# Altium schematic sheet adc.SchDoc
size A3
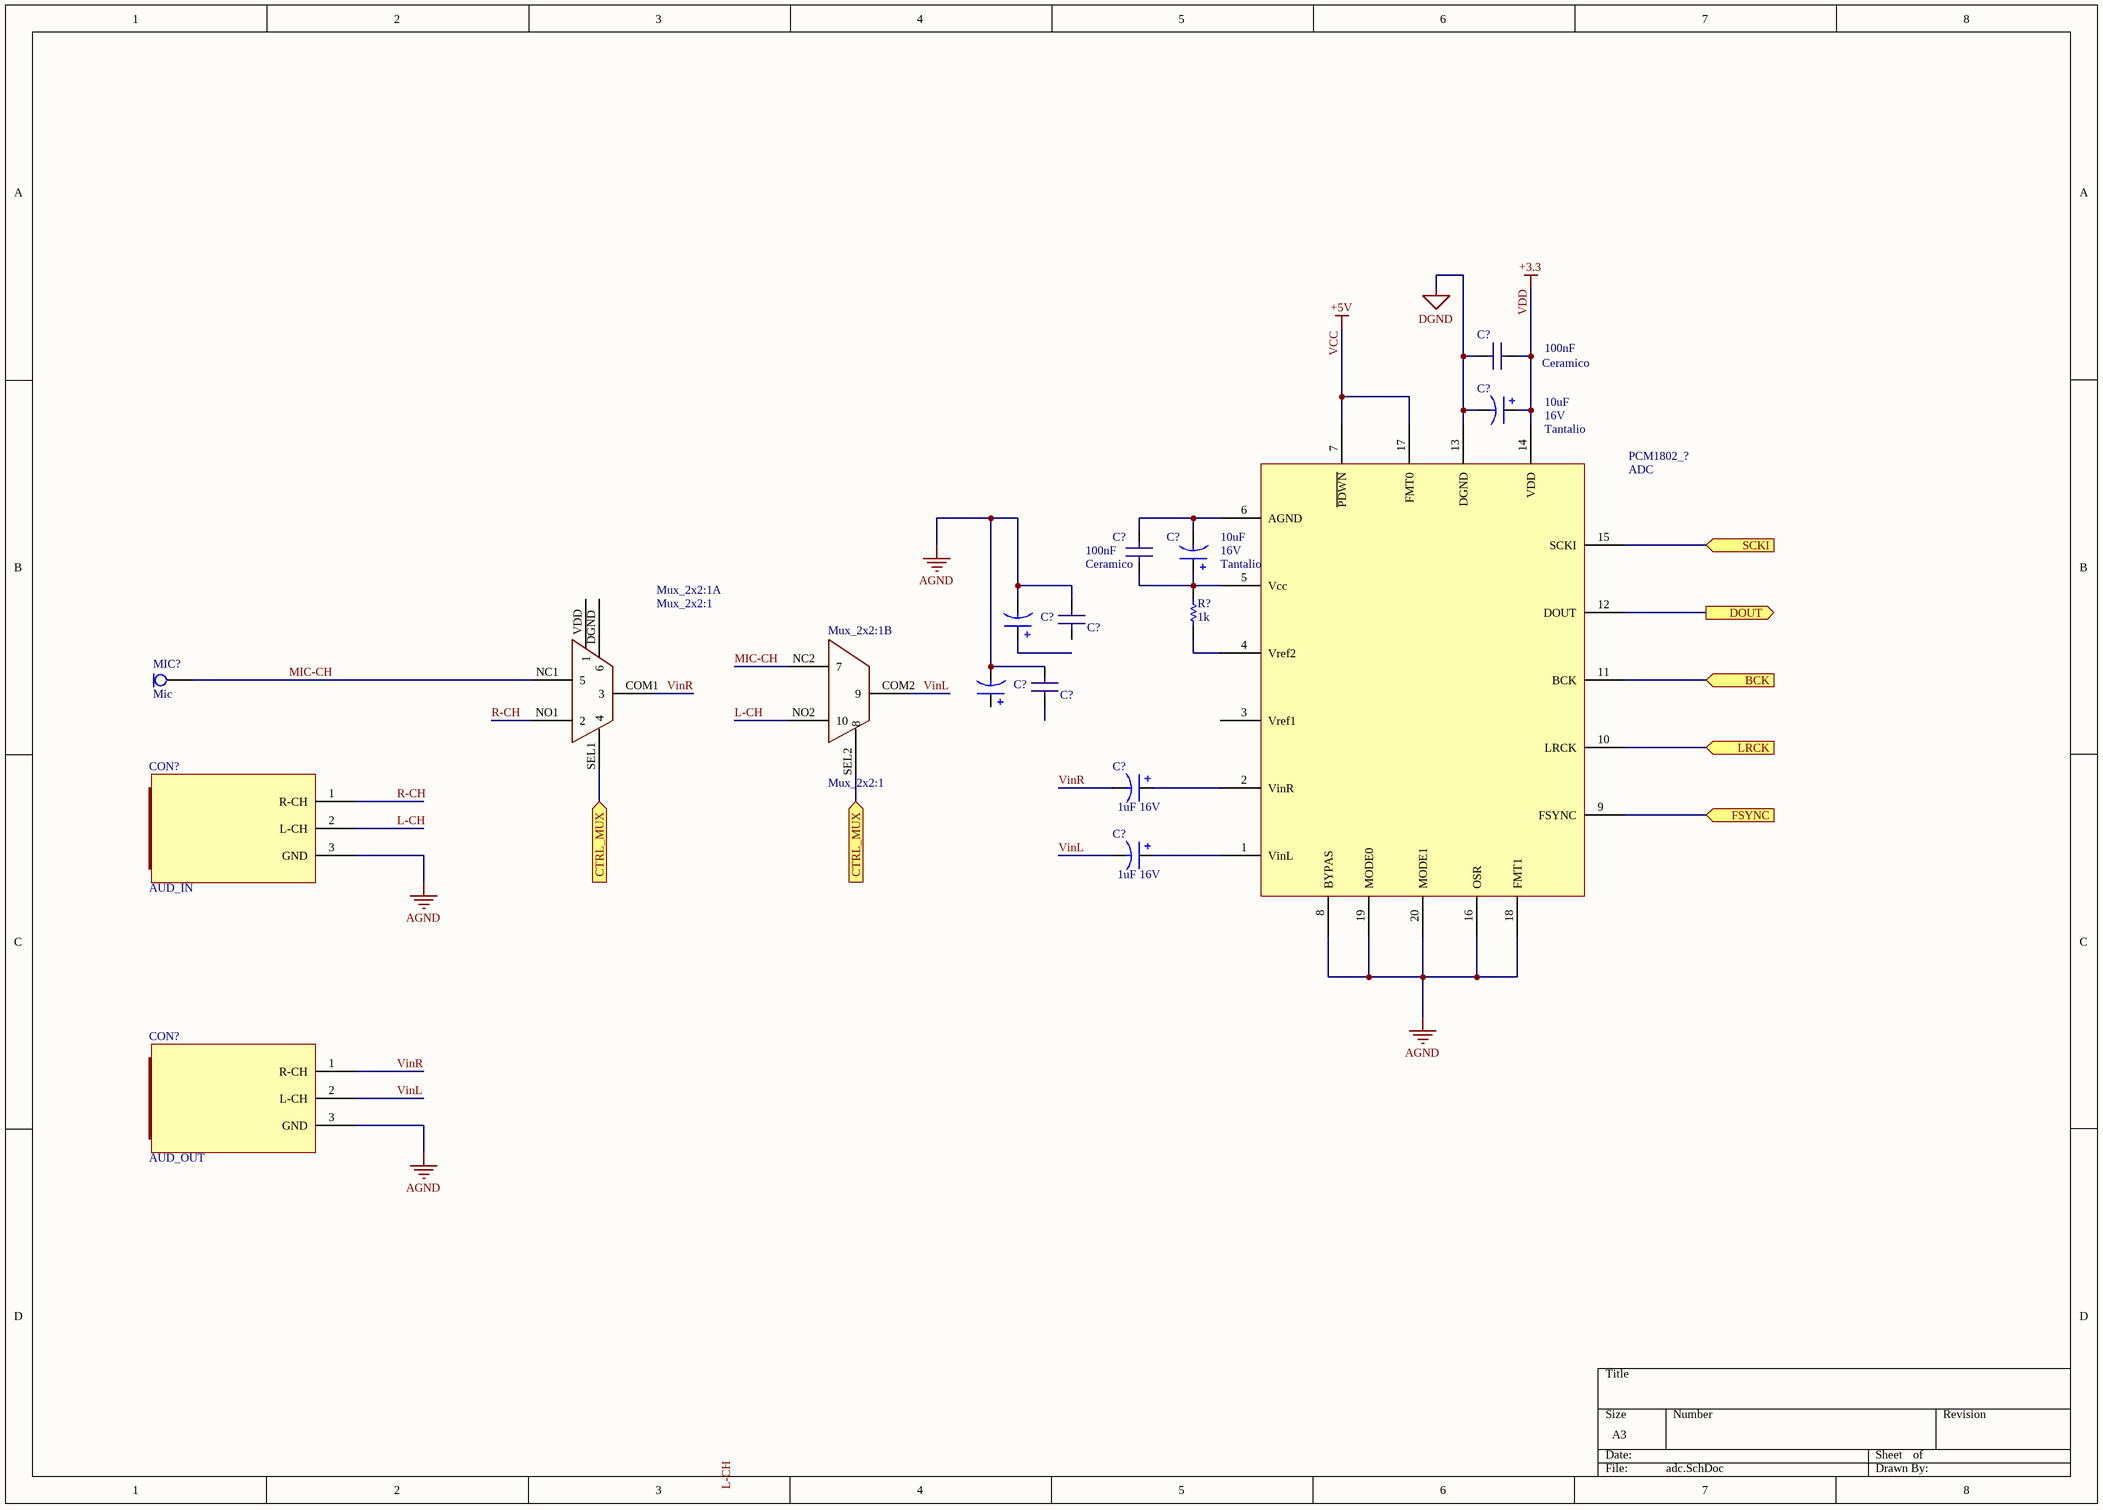
[diagram p0: adc.SchDoc]

## Parts
(Parts that share a designator on the sheet are numbered #1, #2 ... from top to bottom, then left to right.)
C?#1  C: 100nF  [0805]  (hidden comment: Cap1)
C?#2  C: 10uF  V: 16V  Material: Tantalio  [0805]  (hidden comment: C)
C?#3  C: 100nF  [0805]  (hidden comment: Cap1)
C?#4  C: 10uF  V: 16V  Material: Tantalio  [0805]  (hidden comment: C)
C?#5  C  [0805]  (value not drawn)
C?#6  Cap1  [0805]  (value not drawn)
C?#7  C  [0805]  (value not drawn)
C?#8  Cap1  [0805]  (value not drawn)
C?#9  C: 1uF  V: 16V  [0805]  (hidden comment: C)
C?#10  C: 1uF  V: 16V  [0805]  (hidden comment: C)
CON?#1  AUD_IN
CON?#2  AUD_OUT
MIC?  Mic
Mux_2x2:1  Mux_2x2:1  (parts A,B of 2)
PCM1802_?  ADC
R?  value 1k  [0805]  (hidden comment: Res1)

## Ports
BCK (in), CTRL_MUX (in), DOUT (out), FSYNC (in), LRCK (in), SCKI (in)

## Nets
AGND: C?#5.2 C?#6.1 C?#7.2 C?#8.1 CON?#1.3(GND) CON?#2.3(GND) PCM1802_?.8(BYPAS) PCM1802_?.16(OSR) PCM1802_?.18(FMT1) PCM1802_?.19(MODE0) PCM1802_?.20(MODE1)
DGND: C?#1.1 C?#2.2 PCM1802_?.13(DGND)
VCC: PCM1802_?.7(~{PDWN}) PCM1802_?.17(FMT0)  [also labelled +5V]
VDD: C?#1.2 C?#2.1 PCM1802_?.14(VDD)  [also labelled +3.3]
BCK: PCM1802_?.11(BCK) ; port BCK
CTRL_MUX: Mux_2x2:1.SEL1(4) Mux_2x2:1.SEL2(8) ; port CTRL_MUX
DOUT: PCM1802_?.12(DOUT) ; port DOUT
FSYNC: PCM1802_?.9(FSYNC) ; port FSYNC
L-CH: CON?#1.2(L-CH) Mux_2x2:1.NO2(10)
LRCK: PCM1802_?.10(LRCK) ; port LRCK
MIC-CH: MIC?.1 Mux_2x2:1.NC1(5) Mux_2x2:1.NC2(7)
R-CH: CON?#1.1(R-CH) Mux_2x2:1.NO1(2)
SCKI: PCM1802_?.15(SCKI) ; port SCKI
VinL: C?#10.2 CON?#2.2(L-CH) Mux_2x2:1.COM2(9)
VinR: C?#9.2 CON?#2.1(R-CH) Mux_2x2:1.COM1(3)
NetC?#3_1: C?#3.1 C?#4.2 PCM1802_?.6(AGND)
NetC?#3_2: C?#3.2 C?#4.1 PCM1802_?.5(Vcc) R?.2
NetC?#9_1: C?#9.1 PCM1802_?.2(VinR)
NetC?#10_1: C?#10.1 PCM1802_?.1(VinL)
NetPCM1802_?_4: PCM1802_?.4(Vref2) R?.1

Not connected (* = marked no-connect by the designer): C?#5 1; C?#6 2; C?#7 1; C?#8 2; Mux_2x2:1 DGND(6) VDD(1); PCM1802_? 3(Vref1)

## Notes on the sheet
- Labels drawn without touching a wire or pin: L-CH
- (in symbol Cap1) Ceramico

## Library data of the parts
C?#1 C?#3 C?#6 C?#8 = Cap1: Capacitor
  C?#6 C?#8: C: *
C?#2 C?#4 C?#5 C?#7 C?#9 C?#10 = Cap_Elec: Capacitor; Part number: *
  C?#5 C?#7 C?#9 C?#10: Material: *
CON?#1 CON?#2 = Jack_1
MIC? = Mic: Microfono
PCM1802_? = PCM1802
R? = Res1: Resistor